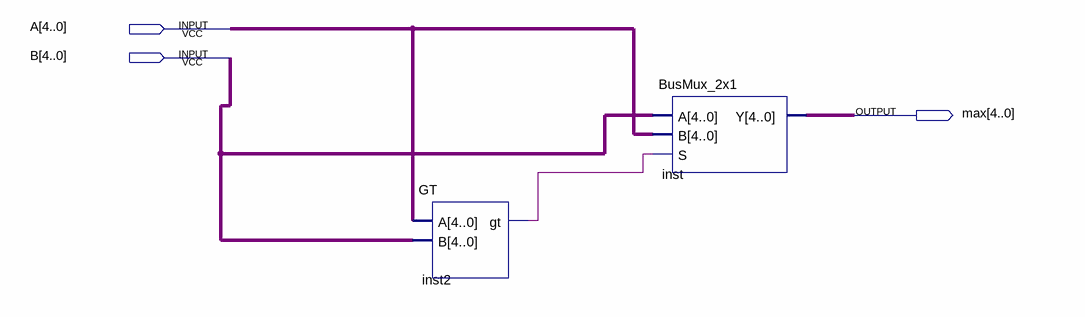
[diagram p0: schematic sheet]
// Quartus schematic Max_AB.bdf as structural Verilog: 2 symbols, 3 pins
module Max_AB (
  input  [4:0] A,
  input  [4:0] B,
  output [4:0] max
);

  wire inst2_gt;

  GT inst2 (.A(A), .B(B), .gt(inst2_gt));
  BusMux_2x1 inst (.A(B), .B(A), .S(inst2_gt), .Y(max));
endmodule
